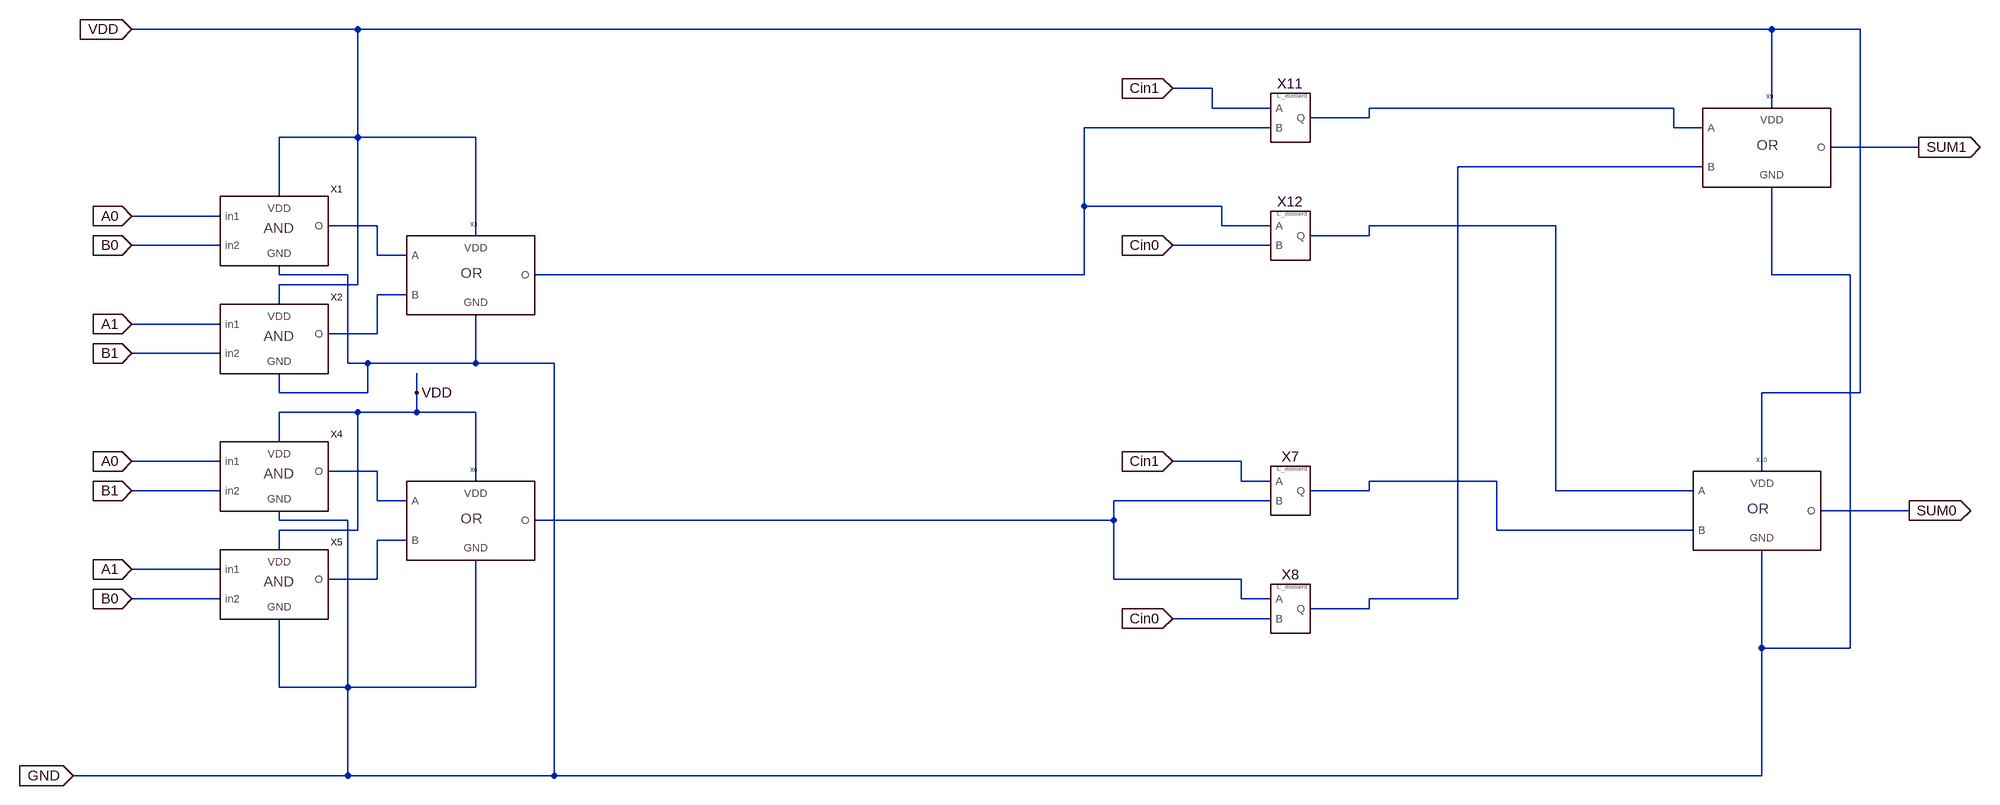
[diagram p0: schematic SL.asc]
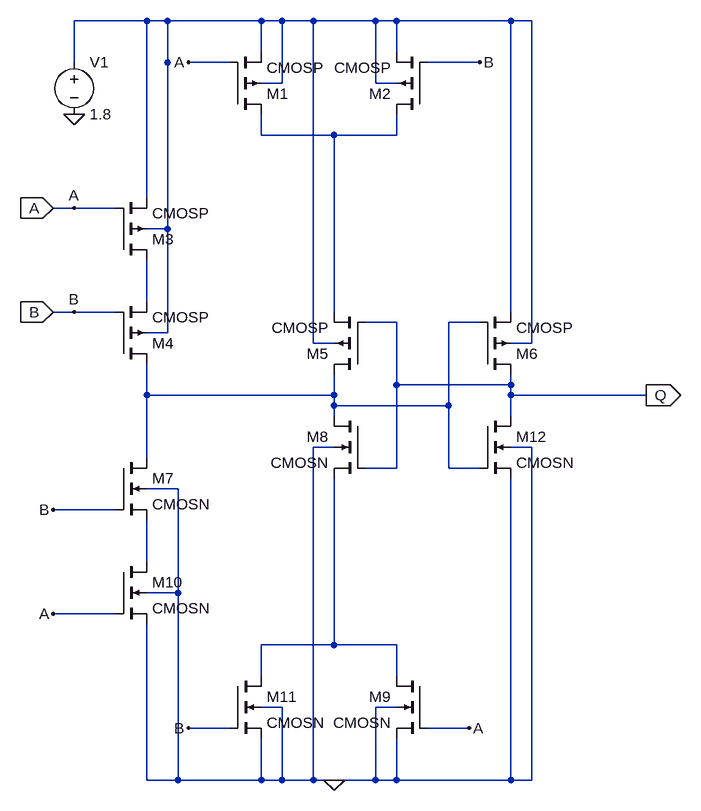
[diagram p1: sub-circuit muller_c_sutherland.asc]
SL.asc, the LTspice schematic file:
Version 4
SHEET 1 2128 680
WIRE -544 -784 -912 -784
WIRE 1760 -784 -544 -784
WIRE 1904 -784 1760 -784
WIRE 848 -688 784 -688
WIRE 848 -656 848 -688
WIRE 944 -656 848 -656
WIRE 1600 -656 1104 -656
WIRE 1760 -656 1760 -784
WIRE 1104 -640 1104 -656
WIRE 1104 -640 1008 -640
WIRE 944 -624 640 -624
WIRE 1600 -624 1600 -656
WIRE 1648 -624 1600 -624
WIRE -544 -608 -544 -784
WIRE -544 -608 -672 -608
WIRE -352 -608 -544 -608
WIRE 2000 -592 1856 -592
WIRE 1648 -560 1248 -560
WIRE -672 -512 -672 -608
WIRE 640 -496 640 -624
WIRE 864 -496 640 -496
WIRE -768 -480 -912 -480
WIRE -512 -464 -592 -464
WIRE 864 -464 864 -496
WIRE 944 -464 864 -464
WIRE 1408 -464 1104 -464
WIRE -352 -448 -352 -608
WIRE 1104 -448 1104 -464
WIRE 1104 -448 1008 -448
WIRE -768 -432 -912 -432
WIRE 944 -432 784 -432
WIRE -512 -416 -512 -464
WIRE -464 -416 -512 -416
WIRE -672 -384 -672 -400
WIRE -560 -384 -672 -384
WIRE 640 -384 640 -496
WIRE 640 -384 -256 -384
WIRE 1760 -384 1760 -528
WIRE 1888 -384 1760 -384
WIRE -544 -368 -544 -608
WIRE -544 -368 -672 -368
WIRE -464 -352 -512 -352
WIRE -672 -336 -672 -368
WIRE -768 -304 -912 -304
WIRE -512 -288 -512 -352
WIRE -512 -288 -592 -288
WIRE -768 -256 -912 -256
WIRE -560 -240 -560 -384
WIRE -528 -240 -560 -240
WIRE -352 -240 -352 -320
WIRE -352 -240 -528 -240
WIRE -224 -240 -352 -240
WIRE -672 -192 -672 -224
WIRE -528 -192 -528 -240
WIRE -528 -192 -672 -192
WIRE -448 -192 -448 -224
WIRE 1904 -192 1904 -784
WIRE 1904 -192 1744 -192
WIRE -544 -160 -672 -160
WIRE -448 -160 -448 -192
WIRE -448 -160 -544 -160
WIRE -352 -160 -448 -160
WIRE -672 -112 -672 -160
WIRE -768 -80 -912 -80
WIRE 896 -80 784 -80
WIRE -512 -64 -592 -64
WIRE 1744 -64 1744 -192
WIRE -352 -48 -352 -160
WIRE 896 -48 896 -80
WIRE 944 -48 896 -48
WIRE 1312 -48 1104 -48
WIRE -768 -32 -912 -32
WIRE 1104 -32 1104 -48
WIRE 1104 -32 1008 -32
WIRE 1408 -32 1408 -464
WIRE 1632 -32 1408 -32
WIRE -512 -16 -512 -64
WIRE -464 -16 -512 -16
WIRE 944 -16 688 -16
WIRE 1984 0 1840 0
WIRE -672 16 -672 0
WIRE -560 16 -672 16
WIRE 688 16 688 -16
WIRE 688 16 -256 16
WIRE -544 32 -544 -160
WIRE -544 32 -672 32
WIRE 1312 32 1312 -48
WIRE 1632 32 1312 32
WIRE -464 48 -512 48
WIRE -672 64 -672 32
WIRE -768 96 -912 96
WIRE -512 112 -512 48
WIRE -512 112 -592 112
WIRE 688 112 688 16
WIRE 896 112 688 112
WIRE -768 144 -912 144
WIRE 896 144 896 112
WIRE 944 144 896 144
WIRE 1248 144 1248 -560
WIRE 1248 144 1104 144
WIRE 1104 160 1104 144
WIRE 1104 160 1008 160
WIRE 944 176 784 176
WIRE 1744 224 1744 64
WIRE 1888 224 1888 -384
WIRE 1888 224 1744 224
WIRE -672 288 -672 176
WIRE -560 288 -560 16
WIRE -560 288 -672 288
WIRE -352 288 -352 80
WIRE -352 288 -560 288
WIRE -560 432 -560 288
WIRE -560 432 -1008 432
WIRE -224 432 -224 -240
WIRE -224 432 -560 432
WIRE 1744 432 1744 224
WIRE 1744 432 -224 432
FLAG -912 -480 A0
IOPIN -912 -480 In
FLAG -912 -304 A1
IOPIN -912 -304 In
FLAG -912 -256 B1
IOPIN -912 -256 In
FLAG -912 -432 B0
IOPIN -912 -432 In
FLAG -912 -80 A0
IOPIN -912 -80 In
FLAG -912 96 A1
IOPIN -912 96 In
FLAG -912 144 B0
IOPIN -912 144 In
FLAG -912 -32 B1
IOPIN -912 -32 In
FLAG 784 -688 Cin1
IOPIN 784 -688 In
FLAG 784 -80 Cin1
IOPIN 784 -80 In
FLAG 784 176 Cin0
IOPIN 784 176 In
FLAG 784 -432 Cin0
IOPIN 784 -432 In
FLAG 2000 -592 SUM1
IOPIN 2000 -592 Out
FLAG 1984 0 SUM0
IOPIN 1984 0 Out
FLAG -912 -784 VDD
IOPIN -912 -784 In
FLAG -1008 432 GND
IOPIN -1008 432 In
FLAG -448 -192 VDD
SYMBOL AND -704 -464 R0
SYMATTR InstName X1
SYMBOL AND -704 -288 R0
SYMATTR InstName X2
SYMBOL or -368 -384 R0
SYMATTR InstName X3
SYMBOL AND -704 -64 R0
SYMATTR InstName X4
SYMBOL AND -704 112 R0
SYMATTR InstName X5
SYMBOL or -368 16 R0
SYMATTR InstName X6
SYMBOL Muller_c_sutherland 976 -32 R0
SYMATTR InstName X7
SYMBOL Muller_c_sutherland 976 160 R0
SYMATTR InstName X8
SYMBOL or 1744 -592 R0
SYMATTR InstName X9
SYMBOL or 1728 0 R0
SYMATTR InstName X10
SYMBOL Muller_c_sutherland 976 -640 R0
SYMATTR InstName X11
SYMBOL Muller_c_sutherland 976 -448 R0
SYMATTR InstName X12

muller_c_sutherland.asc, the sub-circuit schematic file:
Version 4
SHEET 1 880 1236
WIRE -32 -64 -144 -64
WIRE 0 -64 -32 -64
WIRE 144 -64 0 -64
WIRE 176 -64 144 -64
WIRE 224 -64 176 -64
WIRE 320 -64 224 -64
WIRE 352 -64 320 -64
WIRE 528 -64 352 -64
WIRE 560 -64 528 -64
WIRE 144 -16 144 -64
WIRE 352 -16 352 -64
WIRE -144 0 -144 -64
WIRE 96 0 32 0
WIRE 480 0 400 0
WIRE 176 32 176 -64
WIRE 176 32 144 32
WIRE 320 32 320 -64
WIRE 352 32 320 32
WIRE 144 112 144 80
WIRE 256 112 144 112
WIRE 352 112 352 80
WIRE 352 112 256 112
WIRE -32 208 -32 -64
WIRE -144 224 -176 224
WIRE -80 224 -144 224
WIRE 0 256 0 -64
WIRE 0 256 -32 256
WIRE -32 368 -32 304
WIRE -144 384 -176 384
WIRE -80 384 -144 384
WIRE 256 384 256 112
WIRE 528 384 528 -64
WIRE 352 400 304 400
WIRE 480 400 432 400
WIRE 0 416 0 256
WIRE 0 416 -32 416
WIRE 224 432 224 -64
WIRE 256 432 224 432
WIRE 560 432 560 -64
WIRE 560 432 528 432
WIRE 352 496 352 400
WIRE 528 496 528 480
WIRE 528 496 352 496
WIRE -32 512 -32 464
WIRE 256 512 256 480
WIRE 256 512 -32 512
WIRE 528 512 528 496
WIRE 736 512 528 512
WIRE 256 528 256 512
WIRE 432 528 432 400
WIRE 432 528 256 528
WIRE 256 544 256 528
WIRE 528 544 528 512
WIRE 256 592 224 592
WIRE 560 592 528 592
WIRE -32 608 -32 512
WIRE 352 624 352 496
WIRE 352 624 304 624
WIRE 432 624 432 528
WIRE 480 624 432 624
WIRE 16 656 -32 656
WIRE -80 688 -176 688
WIRE -32 768 -32 704
WIRE 16 816 16 656
WIRE 16 816 -32 816
WIRE -80 848 -176 848
WIRE 256 896 256 640
WIRE 256 896 144 896
WIRE 352 896 256 896
WIRE 144 944 144 896
WIRE 352 944 352 896
WIRE 176 992 144 992
WIRE 352 992 320 992
WIRE 96 1024 32 1024
WIRE 464 1024 400 1024
WIRE -32 1104 -32 864
WIRE 16 1104 16 816
WIRE 16 1104 -32 1104
WIRE 144 1104 144 1040
WIRE 144 1104 16 1104
WIRE 176 1104 176 992
WIRE 176 1104 144 1104
WIRE 224 1104 224 592
WIRE 224 1104 176 1104
WIRE 256 1104 224 1104
WIRE 320 1104 320 992
WIRE 320 1104 256 1104
WIRE 352 1104 352 1040
WIRE 352 1104 320 1104
WIRE 528 1104 528 640
WIRE 528 1104 352 1104
WIRE 560 1104 560 592
WIRE 560 1104 528 1104
WIRE 0 0 0 0
FLAG 736 512 Q
IOPIN 736 512 Out
FLAG -176 224 A
IOPIN -176 224 In
FLAG -176 384 B
IOPIN -176 384 In
FLAG 32 0 A
FLAG 480 0 B
FLAG -176 688 B
FLAG -176 848 A
FLAG 32 1024 B
FLAG 464 1024 A
FLAG 256 1104 0
FLAG -144 80 0
FLAG -144 224 A
FLAG -144 384 B
SYMBOL pmos4 96 80 M180
SYMATTR InstName M1
SYMATTR Value CMOSP
SYMATTR Value2 l=180n w=440n
SYMBOL pmos4 400 80 R180
SYMATTR InstName M2
SYMATTR Value CMOSP
SYMATTR Value2 l=180n w=440n
SYMBOL pmos4 -80 304 M180
SYMATTR InstName M3
SYMATTR Value CMOSP
SYMATTR Value2 l=180n w=440n
SYMBOL pmos4 -80 464 M180
SYMATTR InstName M4
SYMATTR Value CMOSP
SYMATTR Value2 l=180n w=440n
SYMBOL pmos4 304 480 R180
SYMATTR InstName M5
SYMATTR Value CMOSP
SYMATTR Value2 l=180n w=440n
SYMBOL pmos4 480 480 M180
SYMATTR InstName M6
SYMATTR Value CMOSP
SYMATTR Value2 l=180n w=440n
SYMBOL nmos4 -80 608 R0
SYMATTR InstName M7
SYMATTR Value CMOSN
SYMATTR Value2 l=180n w=220n
SYMBOL nmos4 304 544 M0
SYMATTR InstName M8
SYMATTR Value CMOSN
SYMATTR Value2 l=180n w=220n
SYMBOL nmos4 400 944 M0
SYMATTR InstName M9
SYMATTR Value CMOSN
SYMATTR Value2 l=180n w=220n
SYMBOL nmos4 -80 768 R0
SYMATTR InstName M10
SYMATTR Value CMOSN
SYMATTR Value2 l=180n w=220n
SYMBOL nmos4 96 944 R0
SYMATTR InstName M11
SYMATTR Value CMOSN
SYMATTR Value2 l=180n w=220n
SYMBOL nmos4 480 544 R0
SYMATTR InstName M12
SYMATTR Value CMOSN
SYMATTR Value2 l=180n w=220n
SYMBOL voltage -144 -16 R0
WINDOW 123 0 0 Left 0
WINDOW 39 0 0 Left 0
SYMATTR InstName V1
SYMATTR Value 1.8

The netlist it stands for:
* SL.asc
XX1 A0 B0 VDD GND N004 AND  ; pins in1 in2 VDD GND O
XX2 A1 B1 VDD GND N006 AND  ; pins in1 in2 VDD GND O
XX3 N004 N006 VDD GND N002 or  ; pins A B VDD GND O
XX4 A0 B1 VDD GND N007 AND  ; pins in1 in2 VDD GND O
XX5 A1 B0 VDD GND N010 AND  ; pins in1 in2 VDD GND O
XX6 N007 N010 VDD GND N009 or  ; pins A B VDD GND O
XX7 Cin1 N009 N008 muller_c_sutherland
XX8 N009 Cin0 N003 muller_c_sutherland
XX9 N001 N003 VDD GND SUM1 or  ; pins A B VDD GND O
XX10 N005 N008 VDD GND SUM0 or  ; pins A B VDD GND O
XX11 Cin1 N002 N001 muller_c_sutherland
XX12 N002 Cin0 N005 muller_c_sutherland

* block symbol definitions
.subckt muller_c_sutherland A B Q
M1 N002 A N001 N001 CMOSP l=180n w=440n
M2 N002 B N001 N001 CMOSP l=180n w=440n
M3 N003 A N001 N001 CMOSP l=180n w=440n
M4 N004 B N003 N001 CMOSP l=180n w=440n
M5 N004 Q N002 N001 CMOSP l=180n w=440n
M6 Q N004 N001 N001 CMOSP l=180n w=440n
M7 N004 B N005 0 CMOSN l=180n w=220n
M8 N004 Q N006 0 CMOSN l=180n w=220n
M9 N006 A 0 0 CMOSN l=180n w=220n
M10 N005 A 0 0 CMOSN l=180n w=220n
M11 N006 B 0 0 CMOSN l=180n w=220n
M12 Q N004 0 0 CMOSN l=180n w=220n
V1 N001 0 1.8
.ends muller_c_sutherland

.model NMOS NMOS
.model PMOS PMOS
.lib standard.mos
.backanno
.end